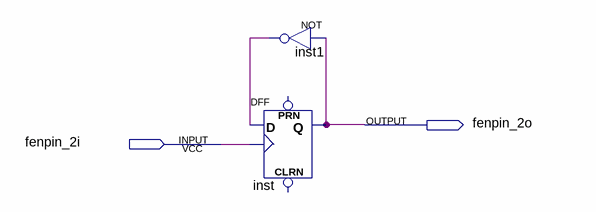
[diagram p0: schematic sheet]
// Quartus schematic fenpin_2.bdf as structural Verilog: 2 symbols, 2 pins
module fenpin_2 (
  input  fenpin_2i,
  output fenpin_2o
);

  wire inst1_out;

  DFF inst (.CLK(fenpin_2i), .D(inst1_out), .Q(fenpin_2o));  // open: CLRN, PRN
  not inst1 (inst1_out, fenpin_2o);
endmodule
